# EAGLE board MainECU rev16 (EAGLE 9.6.2), part 1 of 2
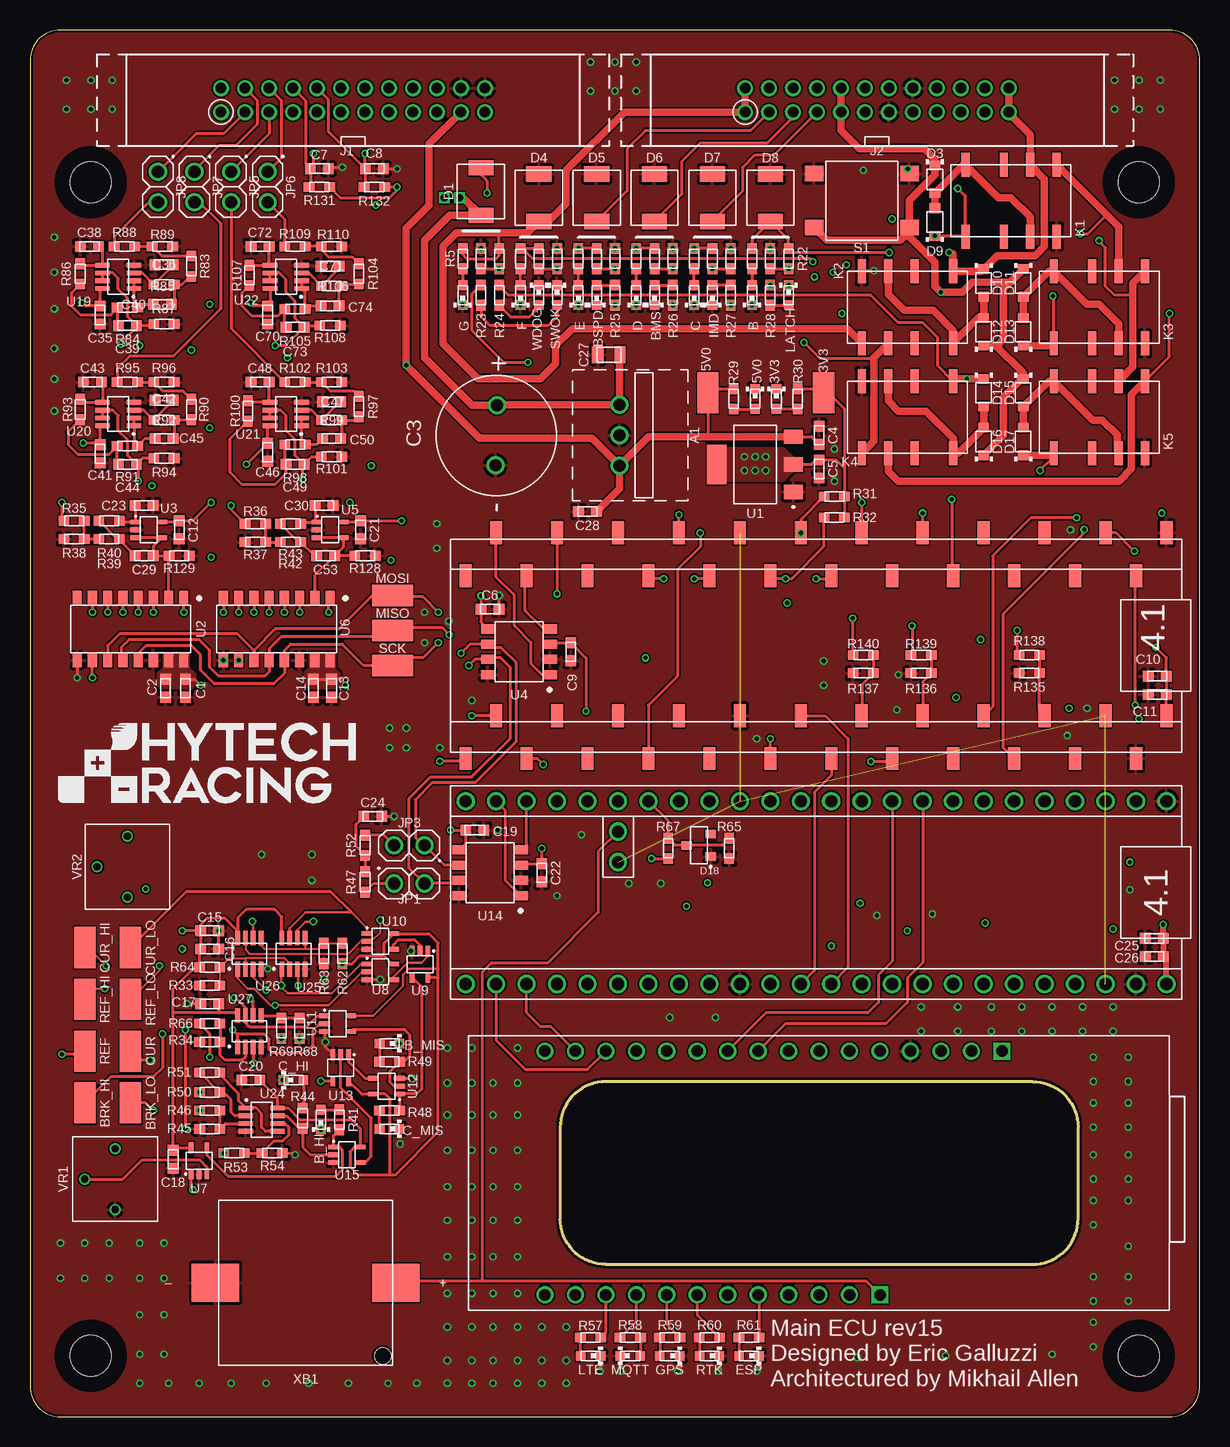
[diagram p9: board, top side]
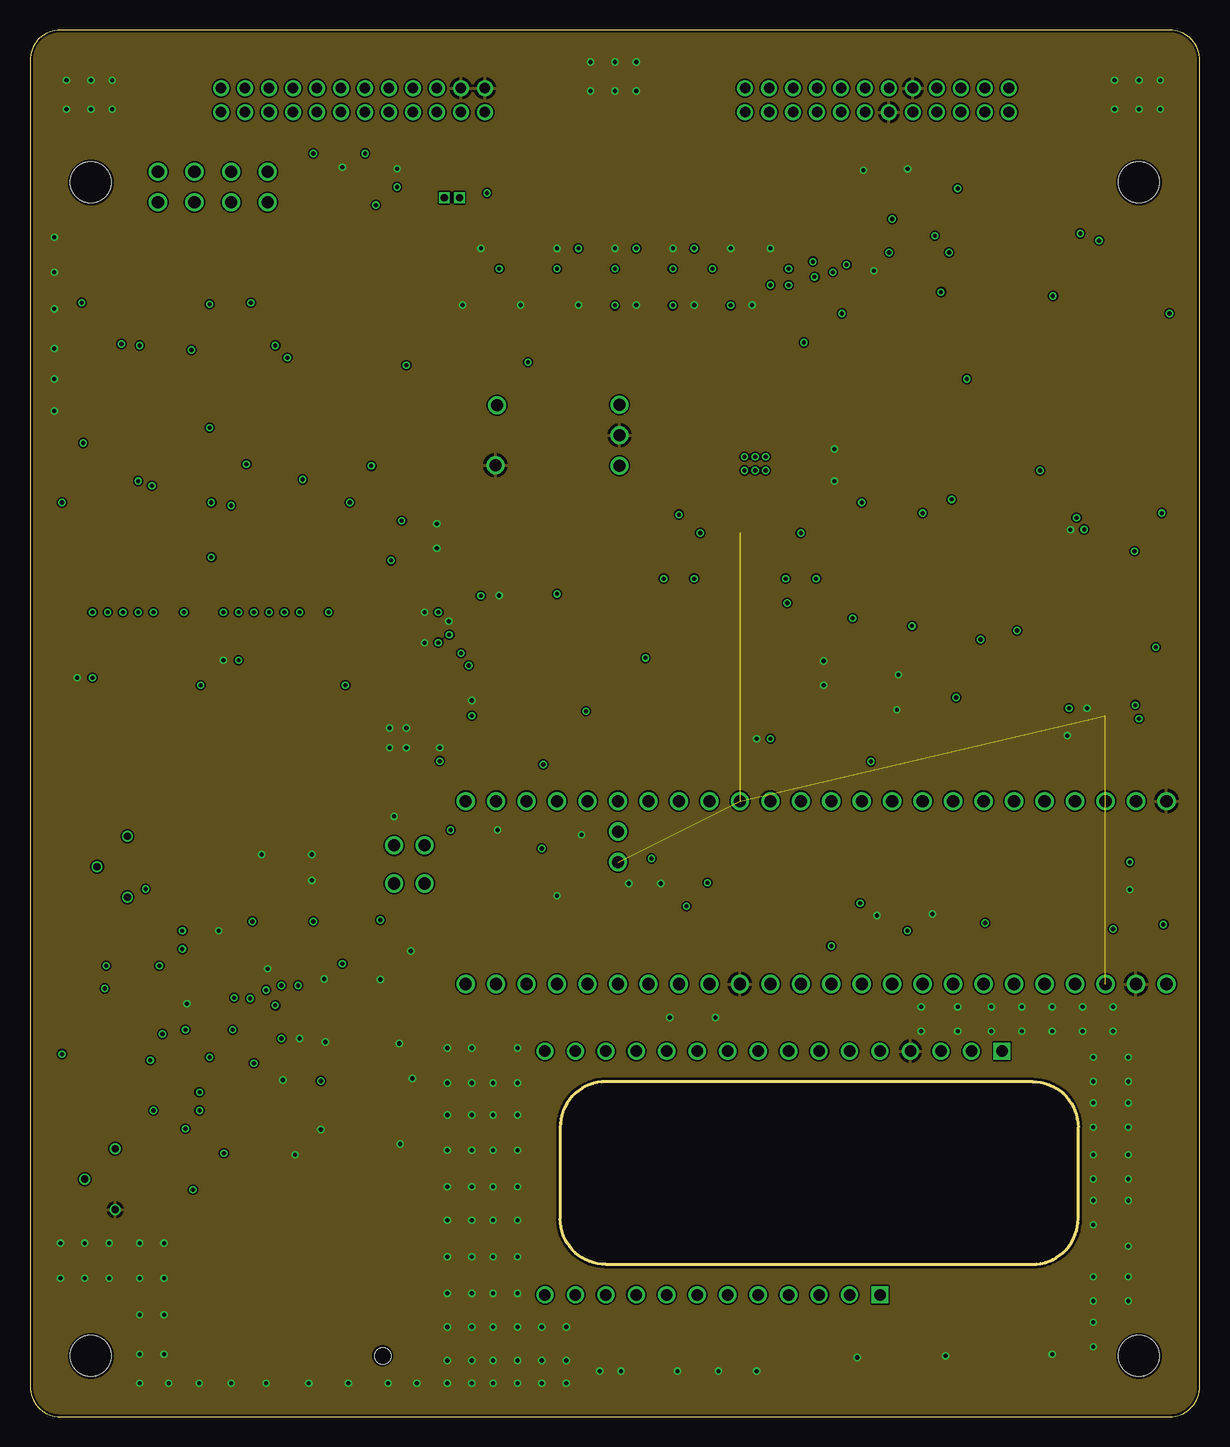
[diagram p10: board, inner layer Route2]
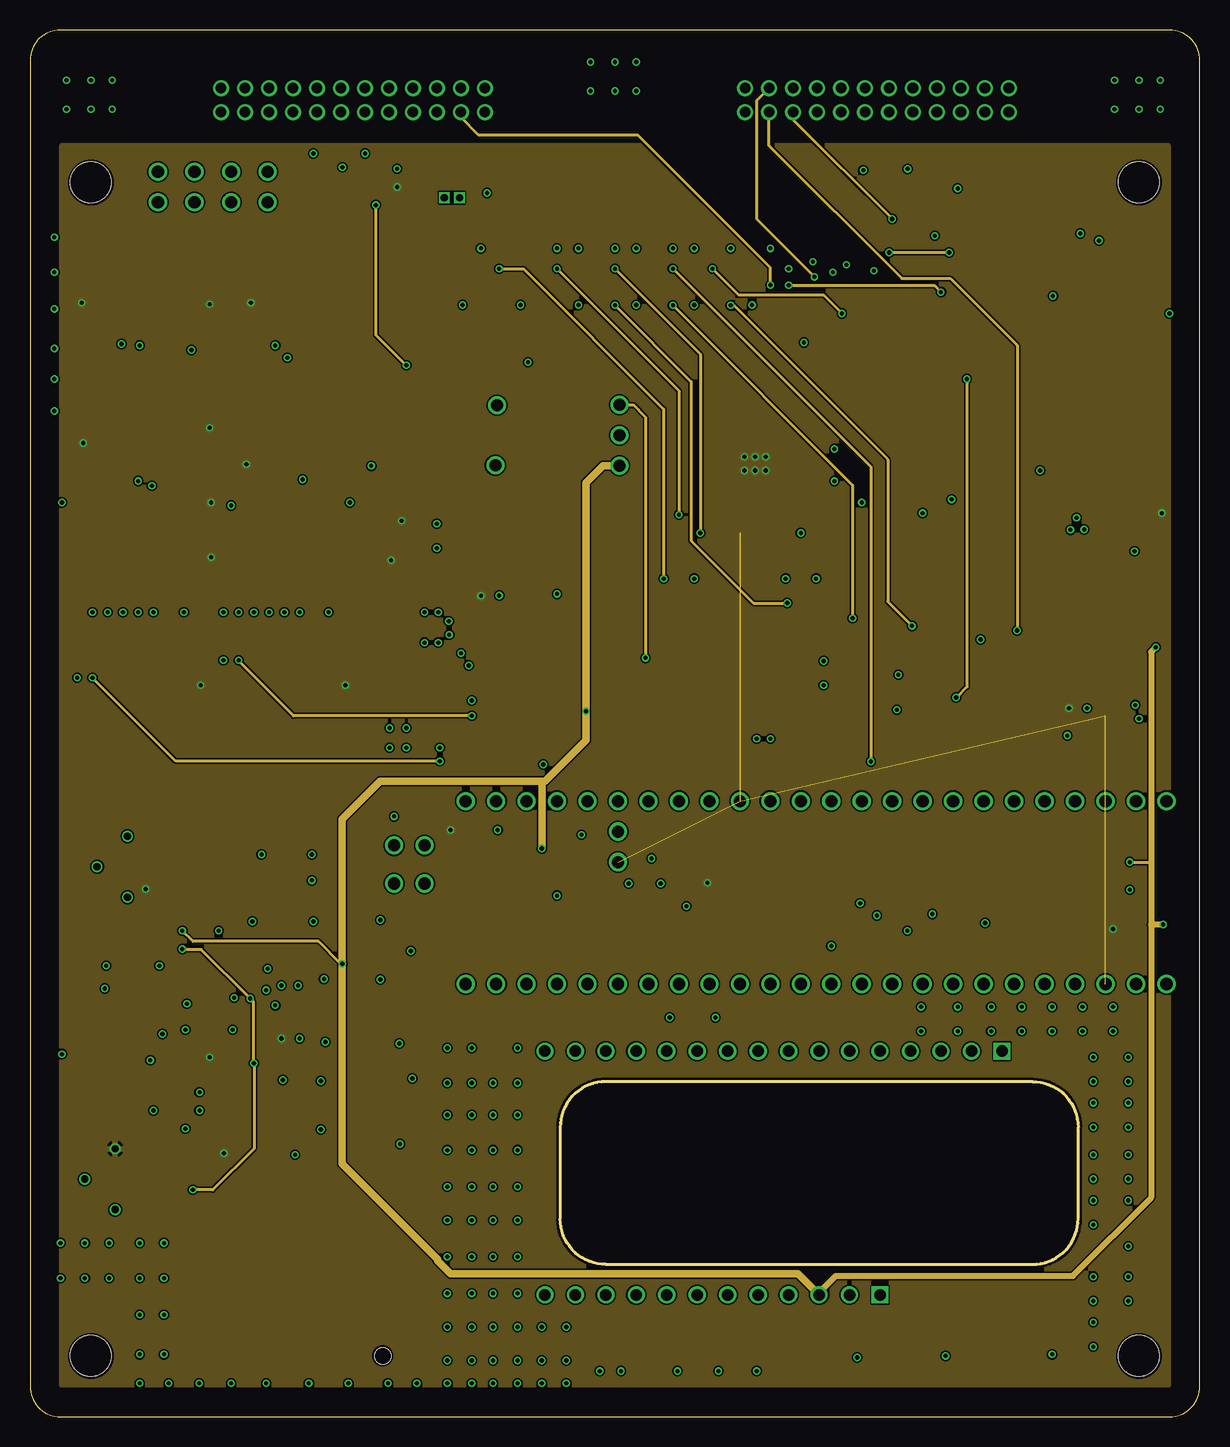
[diagram p11: board, inner layer Route3]
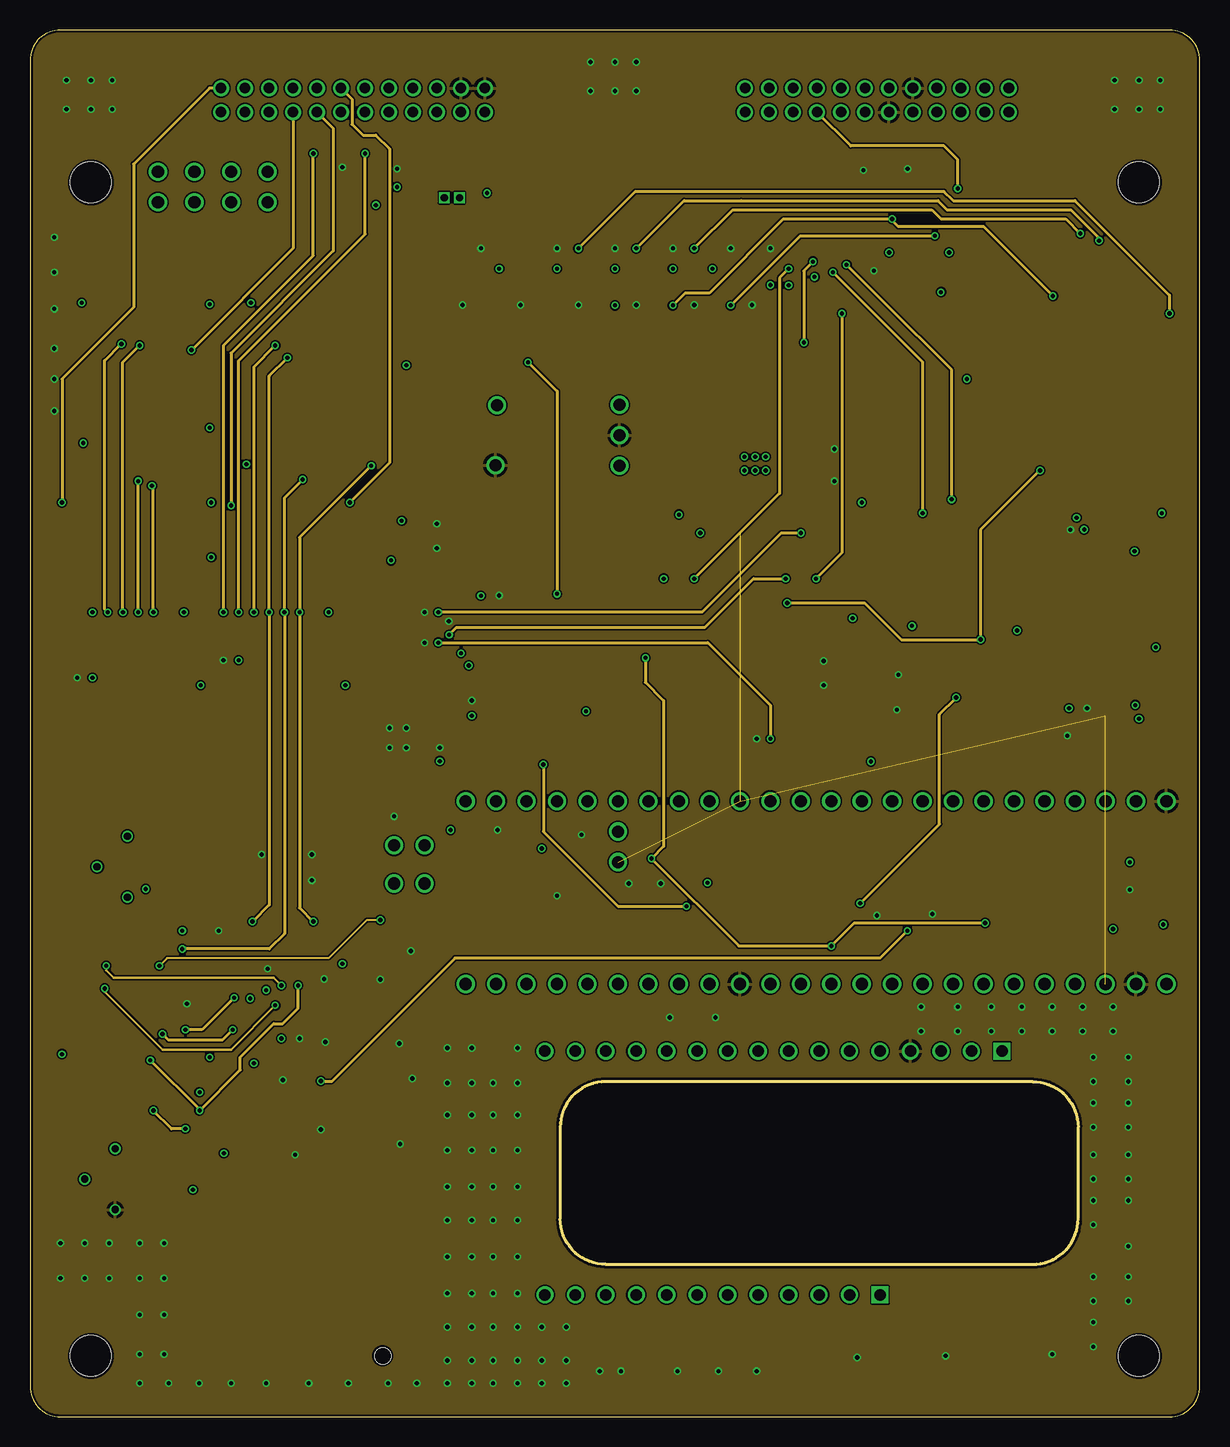
[diagram p12: board, inner layer Route14]
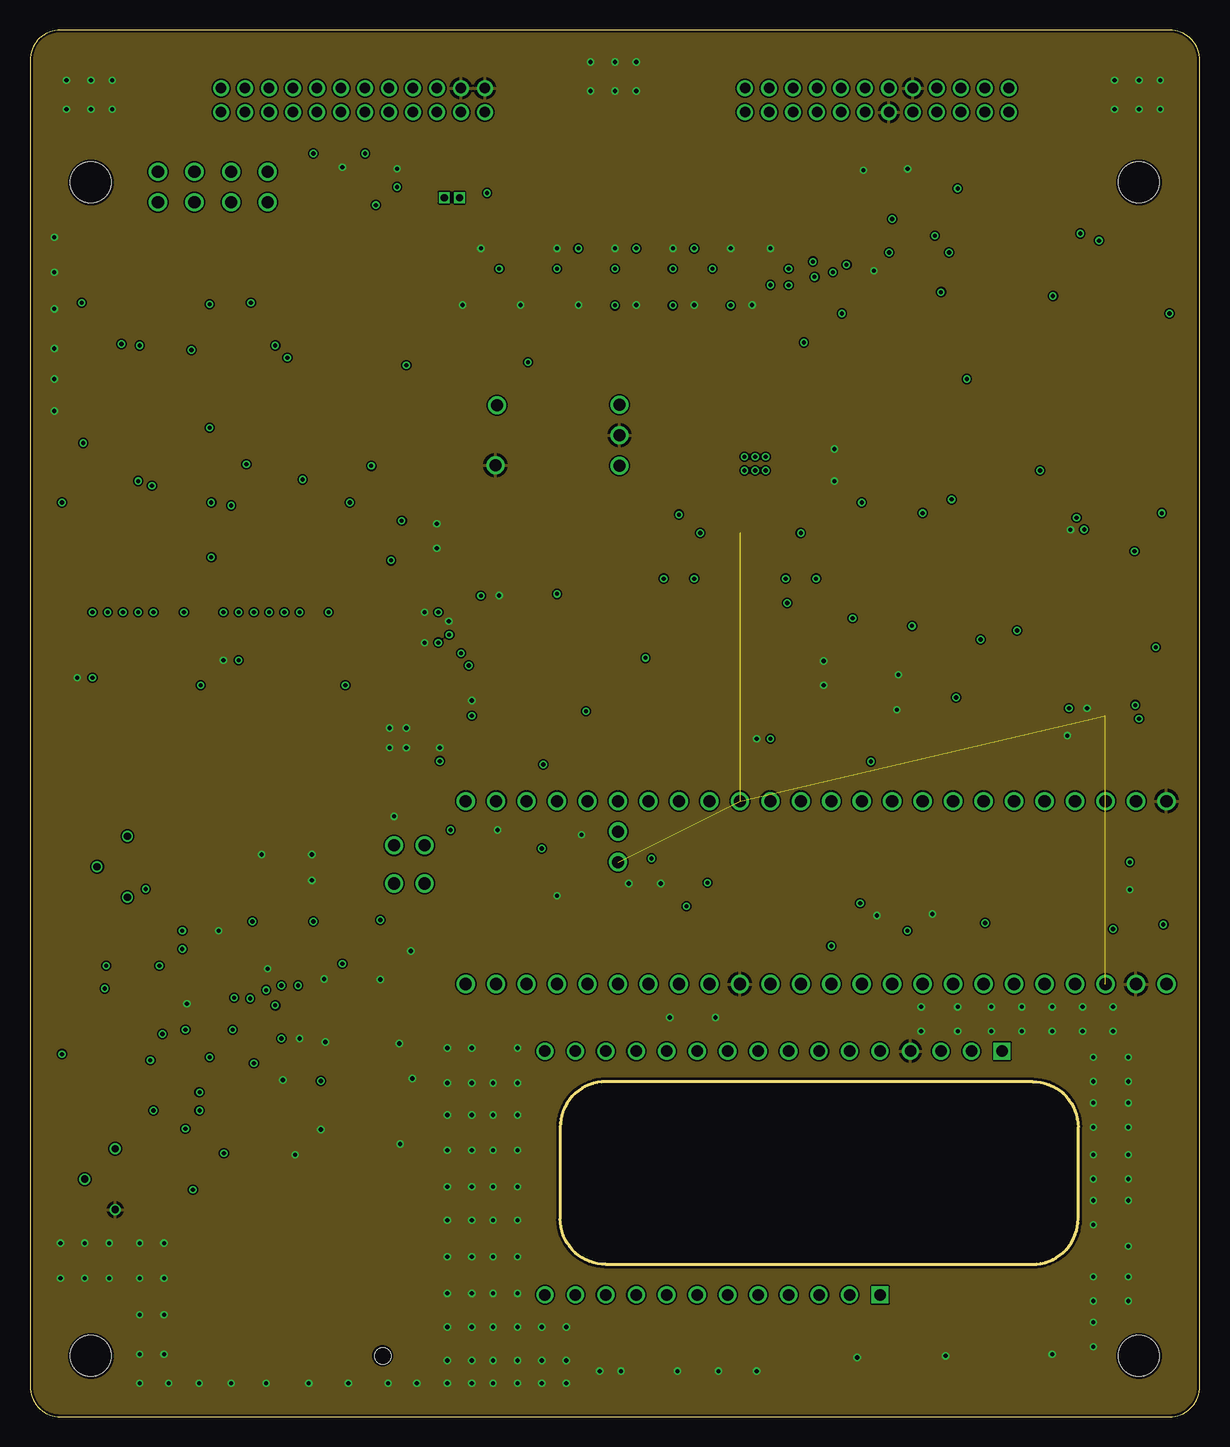
[diagram p13: board, inner layer Route15]
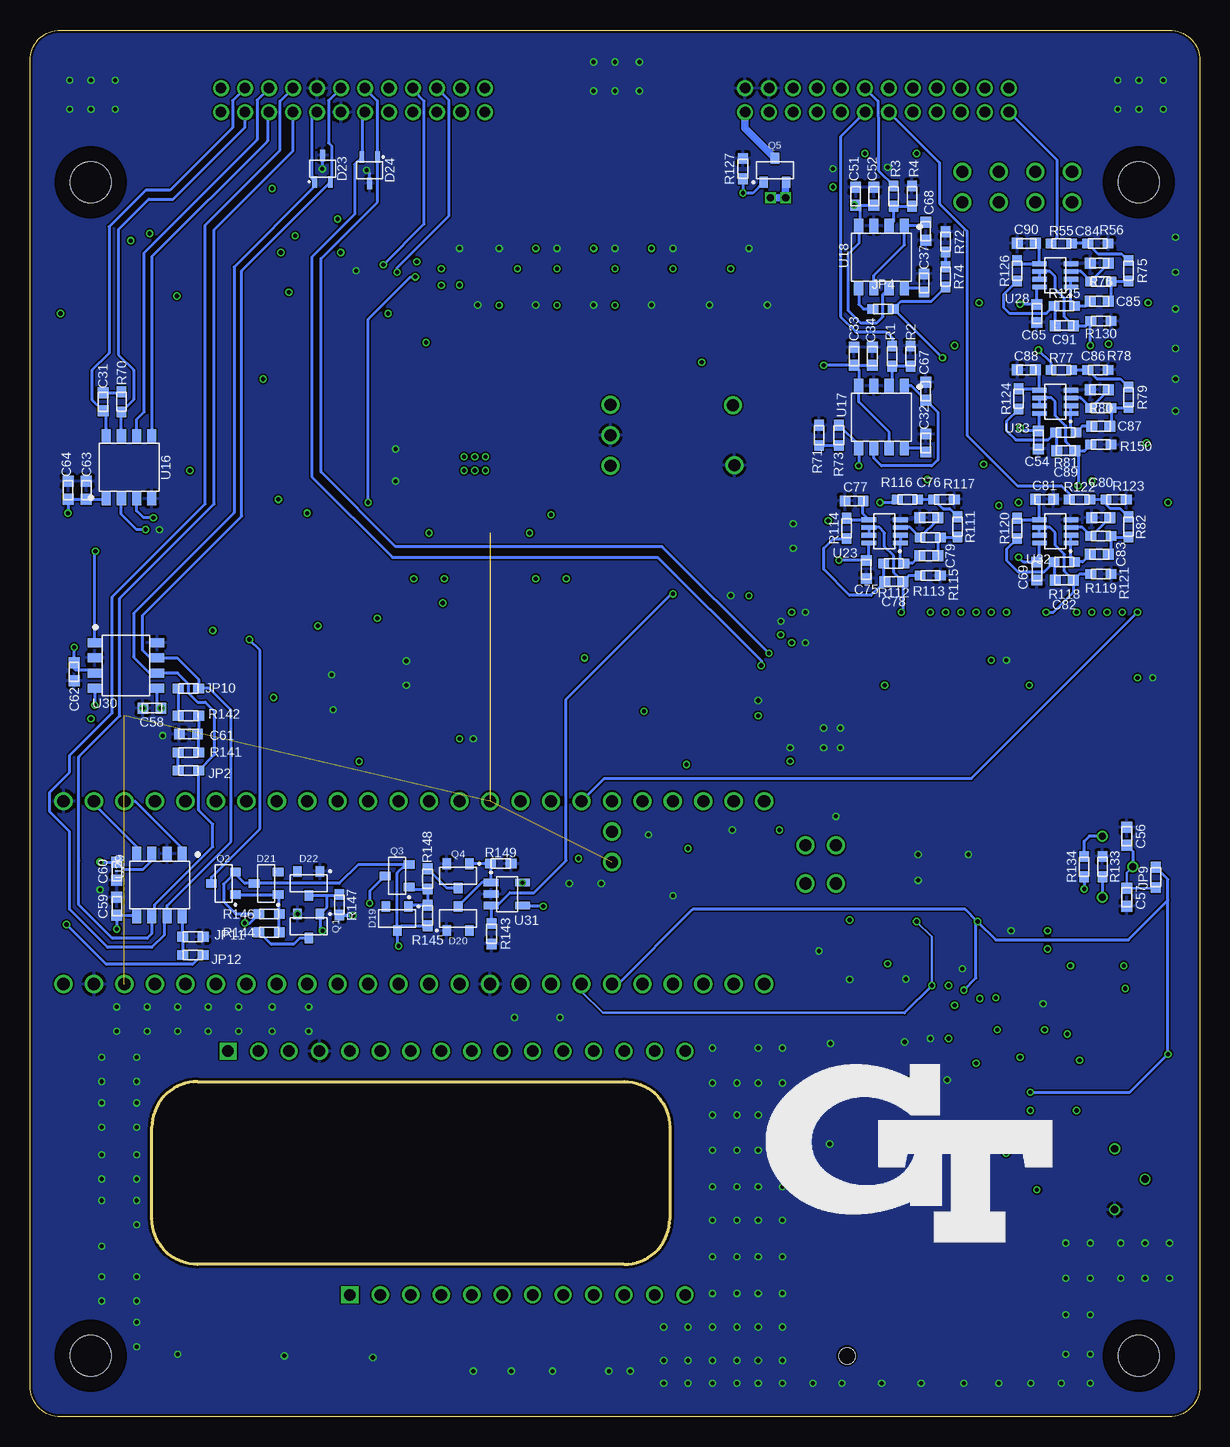
[diagram p14: board, bottom side, seen from below]

Size 97.54 x 115.57 mm. Coordinates in mm from the lower left corner, seen from the top.
Outline: 0,113.03 0,2.54 arc90 2.54,0 95,0 arc90 97.54,2.54 97.54,113.03 arc90 95,115.57 2.54,115.57 arc90 0,113.03
Outline: 44.2,24.13 44.2,16.51 arc90 48.01,12.7 83.57,12.7 arc90 87.38,16.51 87.38,24.13 arc90 83.57,27.94 48.01,27.94 arc90 44.2,24.13
Copper layers (1+2*3+14*15+16): Top 0.035559375mm / dielectric 8mil / Route2 0.035mm / dielectric 15mil / Route3 0.035mm / dielectric 8mil / Route14 0.035mm / dielectric 15mil / Route15 0.035mm / dielectric 8mil / Bottom 0.035559375mm
Design rules "JLCPCB (6 Layer) *": minimum track width 5mil, minimum drill 0.2mm, track to track 5mil, track to pad 5mil, pad to pad 5mil, via to via 20mil, smd to smd 5mil, copper to edge 0.2mm, drill to drill 21mil, minimum pad ring 6mil, minimum via ring 5mil, stop-mask expansion 2mil, vias tented up to drill 30mil, thermal gap 10mil
Net classes: 1 diff pairs: width 0.254 mm

## Footprints (pad centres in the part's own frame; a part is rotated, then mirrored left to right if it is on the bottom)
0603-LED = smd 0.8 x 0.8: 1 -0.825,0; 2 0.825,0
MOUNTING_M3 = hole 3.4: 0,0
OKI-78SR(VERTICAL) = drill 0.991: 1 -2.54,0; 2 0,0; 3 2.54,0
TEENSY_LONG_SSM = smd 1.905 x 1.02: 3.3V -5.842,-24.13; 3.3V@1 9.398,6.35; AGND/GND -9.398,-26.67; D0 5.842,-26.67; D1 9.398,-24.13; D2 5.842,-21.59; D3 9.398,-19.05; D4 5.842,-16.51; D5 9.398,-13.97; D6 5.842,-11.43; D7 9.398,-8.89; D8 5.842,-6.35; D9 9.398,-3.81; D10 5.842,-1.27; D11 9.398,1.27; D12 5.842,3.81; D13 -9.398,3.81; D14 -5.842,1.27; D15 -9.398,-1.27; D16 -5.842,-3.81; D17 -9.398,-6.35; D18 -5.842,-8.89; D19 -9.398,-11.43; D20 -5.842,-13.97; D21 -9.398,-16.51; D22 -5.842,-19.05; D23 -9.398,-21.59; D24 5.842,8.89; D25 9.398,11.43; D26 5.842,13.97; D27 9.398,16.51; D28 5.842,19.05; D29 9.398,21.59; D30 5.842,24.13; D31 9.398,26.67; D32 5.842,29.21; D33 -9.398,29.21; D34 -5.842,26.67; D35 -9.398,24.13; D36 -5.842,21.59; D37 -9.398,19.05; D38 -5.842,16.51; D39 -9.398,13.97; D40 -5.842,11.43; D41 -9.398,8.89; GND 9.398,-29.21; GND@1 -5.842,6.35; VIN -5.842,-29.21
TEENSY_LONG_EXT = drill 1.016: 3V3 0,5.08; 3V3@2 15.24,35.56; 3V3@3 10.16,45.72; AGND/GND 0,2.54; D0 15.24,2.54; D1 15.24,5.08; D2 15.24,7.62; D3 15.24,10.16; D4 15.24,12.7; D5 15.24,15.24; D6 15.24,17.78; D7 15.24,20.32; D8 15.24,22.86; D9 15.24,25.4; D10 15.24,27.94; D11 15.24,30.48; D12 15.24,33.02; D13 0,33.02; D14 0,30.48; D15 0,27.94; D16 0,25.4; D17 0,22.86; D18 0,20.32; D19 0,17.78; D20 0,15.24; D21 0,12.7; D22 0,10.16; D23 0,7.62; D24 15.24,38.1; D25 15.24,40.64; D26 15.24,43.18; D27 15.24,45.72; D28 15.24,48.26; D29 15.24,50.8; D30 15.24,53.34; D31 15.24,55.88; D32 15.24,58.42; D33 0,58.42; D34 0,55.88; D35 0,53.34; D36 0,50.8; D37 0,48.26; D38 0,45.72; D39 0,43.18; D40 0,40.64; D41 0,38.1; GND 15.24,0; GND@2 0,35.56; VBAT 12.7,45.72; VIN 0,0
NRF9160LTE = drill 0.95: 2 -10.16,46.99; 3 -10.16,44.45; 3V3 10.16,16.51; 4 -10.16,41.91; 5 -10.16,39.37; 6 -10.16,36.83; 7 -10.16,34.29; 8 -10.16,31.75; A0 10.16,24.13; A1 10.16,26.67; A2 10.16,29.21; A3 10.16,31.75; A4 10.16,34.29; A5 10.16,36.83; CIPO 10.16,44.45; COPI 10.16,41.91; EN -10.16,26.67; GND 10.16,21.59; MD 10.16,19.05; PS-EN 10.16,52.07; RX 10.16,46.99; SCK 10.16,39.37; SCL/1 -10.16,49.53; SDA/0 -10.16,52.07; TX 10.16,49.53; VUSB -10.16,29.21 | drill 0.95 square: RESET 10.16,13.97; VBAT -10.16,24.13
0603-CAP = smd 0.9 x 0.9: 1 -0.75,0; 2 0.75,0
EEH-AZS = drill 1: MINUS 2.5,0; PLUS -2.5,0
0805-CAP = smd 0.95 x 1.4: 1 -0.925,0; 2 0.925,0
5015 = smd 3.429 x 1.778: 1 0,0
1.5SMBJ = smd 1.27 x 2.1: 1 -1.98,0; 2 1.98,0
SOD-323 = smd 0.8 x 0.9: A -1.15,0; C 1.15,0
SOT-23 = smd 0.711 x 0.889: 1 -0.94,-1.003; 2 0.94,-1.003; 3 0,1.003
SC-70-3 = smd 0.95 x 0.4: 1 -1.1,0.65; 2 -1.1,-0.65; 3 1.1,0
EHT-112-01 = drill 0.889: 1 -10.994,-0.999; 2 -10.994,0.999; 3 -8.995,-0.999; 4 -8.995,0.999; 5 -6.996,-0.999; 6 -6.996,0.999; 7 -4.997,-0.999; 8 -4.997,0.999; 9 -2.998,-0.999; 10 -2.998,0.999; 11 -0.999,-0.999; 12 -0.999,0.999; 13 0.999,-0.999; 14 0.999,0.999; 15 2.998,-0.999; 16 2.998,0.999; 17 4.997,-0.999; 18 4.997,0.999; 19 6.996,-0.999; 20 6.996,0.999; 21 8.995,-0.999; 22 8.995,0.999; 23 10.994,-0.999; 24 10.994,0.999
1X02 = drill 1.016: 1 -1.27,0; 2 1.27,0
0603-RES = smd 0.9 x 0.8: 1 -0.85,0; 2 0.85,0
IM*G = smd 0.7 x 2: 1 -3.8,-3; 2 -0.6,-3; 3 1.6,-3; 4 3.8,-3; 5 3.8,3; 6 1.6,3; 7 -0.6,3; 8 -3.8,3
B3S-100X = smd 1.55 x 1.3: 1 3.975,-2.25; 2 -3.975,-2.25; 3 3.975,2.25; 4 -3.975,2.25
SOT-223 = smd 1.2 x 1.6: 1 -2.3,-3.2; 2 0,-3.2; 3 2.3,-3.2 | smd 3.3 x 1.6: 4 0,3.2
SOIC-16 = smd 0.762 x 1.143: 1 -4.445,-2.603; 2 -3.175,-2.603; 3 -1.905,-2.603; 4 -0.635,-2.603; 5 0.635,-2.603; 6 1.905,-2.603; 7 3.175,-2.603; 8 4.445,-2.603; 9 4.445,2.603; 10 3.175,2.603; 11 1.905,2.603; 12 0.635,2.603; 13 -0.635,2.603; 14 -1.905,2.603; 15 -3.175,2.603; 16 -4.445,2.603
SC-70-5 = smd 0.4 x 0.9: 1 -0.65,-1.1; 2 0,-1.1; 3 0.65,-1.1; 4 0.65,1.1; 5 -0.65,1.1
SOIC-08(NARROW,0.15") = smd 0.762 x 1.143: 1 -1.905,-2.603; 2 -0.635,-2.603; 3 0.635,-2.603; 4 1.905,-2.603; 5 1.905,2.603; 6 0.635,2.603; 7 -0.635,2.603; 8 -1.905,2.603
SOT-23-8 = smd 0.4 x 1.22: 1 -0.975,-1.31; 2 -0.325,-1.31; 3 0.325,-1.31; 4 0.975,-1.31; 5 0.975,1.31; 6 0.325,1.31; 7 -0.325,1.31; 8 -0.975,1.31
SOT-23-5 = smd 0.62 x 1.22: 1 -0.95,-1.31; 2 0,-1.31; 3 0.95,-1.31; 4 0.95,1.31; 5 -0.95,1.31
3362P = drill 0.6: 1 -2.54,0; 2 0,2.54; 3 2.54,0
498 = smd 3.962 x 3.175: 1 -7.518,0; 2 7.518,0 | hole 1.346: -6.426,6.096

## Placement (x,y rotation side)
3V3  LED_0603_YELLOW  [0603-LED]  62.23,84.84 270 top
5V0  LED_0603_YELLOW  [0603-LED]  60.45,84.84 270 top
$$$$U$1  [MOUNTING_M3]  5.08,5.08 0 top
$$$$U$2  [MOUNTING_M3]  92.46,5.08 0 top
$$U$2  [MOUNTING_M3]  92.46,102.87 0 top
A1  VOLTAGE_REGULATOR_MODULE_OKI-78SR_5V  [OKI-78SR(VERTICAL)]  49.15,81.79 270 top
A2  TEENSY_4.1_SMT  [TEENSY_LONG_SSM]  65.53,64.26 90 top
A3  TEENSY_4.1  [TEENSY_LONG_EXT]  94.74,36.07 90 top
A4  NRF9160LTE  [NRF9160LTE]  95,20.32 90 top
B  LED_0603_GREEN  [0603-LED]  60.2,93.47 90 top
B_HI  LED_0603_RED  [0603-LED]  24.26,24.77 90 top
B_MIS  LED_0603_RED  [0603-LED]  29.97,31.11 180 top
BMS  LED_0603_ORANGE  [0603-LED]  52.07,93.47 90 top
BSPD  LED_0603_GREEN  [0603-LED]  47.24,93.47 90 top
C  LED_0603_GREEN  [0603-LED]  55.37,93.47 90 top
C1  CAPACITOR_0603_10V_0.1UF  [0603-CAP]  12.95,60.71 270 top
C2  CAPACITOR_0603_10V_1UF  [0603-CAP]  11.3,60.71 270 top
C3  CAPACITOR_ELECTROLYTIC_EEH_AZS_470UF  [EEH-AZS]  38.86,81.79 268.4 top
C4  CAPACITOR_0603_25V_10UF  [0603-CAP]  65.79,81.79 90 top
C5  CAPACITOR_0603_25V_10UF  [0603-CAP]  65.79,78.99 270 top
C6  CAPACITOR_0603_10V_0.1UF  [0603-CAP]  38.35,67.31 0 top
C7  CAPACITOR_0603_50V_1UF  [0603-CAP]  24.13,104.01 0 top
C8  CAPACITOR_0603_50V_1UF  [0603-CAP]  28.7,104.01 0 top
C9  CAPACITOR_0603_10V_0.1UF  [0603-CAP]  45.09,63.75 270 top
C10  CAPACITOR_0603_10V_0.1UF  [0603-CAP]  93.98,61.72 180 top
C11  CAPACITOR_0603_10V_1UF  [0603-CAP]  93.98,60.2 180 top
C12  CAPACITOR_0603_10V_0.1UF  [0603-CAP]  12.45,73.91 270 top
C13  CAPACITOR_0603_10V_1UF  [0603-CAP]  25.15,60.71 270 top
C14  CAPACITOR_0603_10V_0.1UF  [0603-CAP]  23.62,60.71 270 top
C15  CAPACITOR_0603_10V_0.1UF  [0603-CAP]  14.99,40.51 0 top
C16  CAPACITOR_0603_10V_0.1UF  [0603-CAP]  14.99,38.99 0 top
C17  CAPACITOR_0603_10V_0.1UF  [0603-CAP]  14.99,34.42 180 top
C18  CAPACITOR_0603_10V_0.1UF  [0603-CAP]  11.94,21.46 270 top
C19  CAPACITOR_0603_10V_0.1UF  [0603-CAP]  37.08,48.9 0 top
C20  CAPACITOR_0603_10V_0.1UF  [0603-CAP]  18.41,28.07 180 top
C21  CAPACITOR_0603_10V_0.1UF  [0603-CAP]  27.56,73.91 270 top
C22  CAPACITOR_0603_10V_0.1UF  [0603-CAP]  42.67,45.34 270 top
C23  CAPACITOR_0603_16V_0.47UF  [0603-CAP]  9.53,75.95 180 top
C24  CAPACITOR_0603_10V_4.7NF  [0603-CAP]  28.57,50.04 0 top
C25  CAPACITOR_0603_10V_0.1UF  [0603-CAP]  93.73,39.88 180 top
C26  CAPACITOR_0603_10V_1UF  [0603-CAP]  93.73,38.35 180 top
C27  CAPACITOR_0805_50V_10UF  [0805-CAP]  48.26,88.52 180 top
C28  CAPACITOR_0603_25V_10UF  [0603-CAP]  46.48,75.44 180 top
C29  CAPACITOR_0603_10V_1UF  [0603-CAP]  9.53,71.75 180 top
C30  CAPACITOR_0603_16V_0.47UF  [0603-CAP]  24.51,75.95 180 top
C31  CAPACITOR_0603_25V_1.2NF  [0603-CAP]  91.44,84.58 270 bottom
C32  CAPACITOR_0603_10V_10NF  [0603-CAP]  22.86,81.15 90 bottom
C33  CAPACITOR_0603_10V_0.1UF  [0603-CAP]  28.83,88.39 90 bottom
C34  CAPACITOR_0603_10V_1UF  [0603-CAP]  27.3,88.39 90 bottom
C35  CAPACITOR_0603_10V_0.1UF  [0603-CAP]  5.84,91.82 270 top
C36  CAPACITOR_0603_16V_0.47UF  [0603-CAP]  11.18,96.01 0 top
C37  CAPACITOR_0603_10V_10NF  [0603-CAP]  22.99,94.49 90 bottom
C38  CAPACITOR_0603_16V_0.47UF  [0603-CAP]  4.95,97.54 0 top
C39  CAPACITOR_0603_10V_1UF  [0603-CAP]  8.13,90.93 180 top
C40  CAPACITOR_0603_10V_1UF  [0603-CAP]  11.05,92.71 0 top
C41  CAPACITOR_0603_10V_0.1UF  [0603-CAP]  5.84,80.26 270 top
C42  CAPACITOR_0603_16V_0.47UF  [0603-CAP]  11.18,84.71 0 top
C43  CAPACITOR_0603_16V_0.47UF  [0603-CAP]  5.21,86.23 0 top
C44  CAPACITOR_0603_10V_1UF  [0603-CAP]  8.13,79.38 180 top
C45  CAPACITOR_0603_10V_1UF  [0603-CAP]  11.18,81.53 0 top
C46  CAPACITOR_0603_10V_0.1UF  [0603-CAP]  19.81,80.39 270 top
C47  CAPACITOR_0603_16V_0.47UF  [0603-CAP]  25.15,84.58 0 top
C48  CAPACITOR_0603_16V_0.47UF  [0603-CAP]  19.18,86.23 0 top
C49  CAPACITOR_0603_10V_1UF  [0603-CAP]  22.1,79.38 180 top
C50  CAPACITOR_0603_10V_1UF  [0603-CAP]  25.15,81.53 0 top
C51  CAPACITOR_0603_10V_0.1UF  [0603-CAP]  28.7,101.73 90 bottom
C52  CAPACITOR_0603_10V_1UF  [0603-CAP]  27.18,101.73 90 bottom
C53  CAPACITOR_0603_10V_1UF  [0603-CAP]  24.64,71.75 180 top
C54  CAPACITOR_0603_10V_0.1UF  [0603-CAP]  13.46,81.41 270 bottom
C56  CAPACITOR_0603_10V_1UF  [0603-CAP]  6.1,48.39 90 bottom
C57  CAPACITOR_0603_10V_0.1UF  [0603-CAP]  6.1,43.31 270 bottom
C58  CAPACITOR_0603_10V_0.1UF  [0603-CAP]  87.38,59.05 180 bottom
C59  CAPACITOR_0603_10V_0.1UF  [0603-CAP]  90.3,42.55 90 bottom
C60  CAPACITOR_0603_10V_0.1UF  [0603-CAP]  90.3,45.47 270 bottom
C61  CAPACITOR_0603_10V_4.7NF  [0603-CAP]  84.33,56.9 180 bottom
C62  CAPACITOR_0603_10V_0.1UF  [0603-CAP]  93.85,62.1 270 bottom
C63  CAPACITOR_0603_10V_0.1UF  [0603-CAP]  92.84,77.22 90 bottom
C64  CAPACITOR_0603_10V_1UF  [0603-CAP]  94.36,77.22 90 bottom
C65  CAPACITOR_0603_10V_0.1UF  [0603-CAP]  13.59,91.95 270 bottom
C67  CAPACITOR_0603_10V_0.1UF  [0603-CAP]  22.86,85.47 270 bottom
C68  CAPACITOR_0603_10V_0.1UF  [0603-CAP]  22.86,98.81 270 bottom
C69  CAPACITOR_0603_10V_0.1UF  [0603-CAP]  13.59,70.48 270 bottom
C70  CAPACITOR_0603_10V_0.1UF  [0603-CAP]  19.81,91.82 270 top
C71  CAPACITOR_0603_16V_0.47UF  [0603-CAP]  25.02,95.89 0 top
C72  CAPACITOR_0603_16V_0.47UF  [0603-CAP]  19.18,97.54 0 top
C73  CAPACITOR_0603_10V_1UF  [0603-CAP]  22.1,90.81 180 top
C74  CAPACITOR_0603_10V_1UF  [0603-CAP]  25.02,92.58 0 top
C75  CAPACITOR_0603_10V_0.1UF  [0603-CAP]  27.81,70.61 270 bottom
C76  CAPACITOR_0603_16V_0.47UF  [0603-CAP]  22.61,74.93 0 bottom
C77  CAPACITOR_0603_16V_0.47UF  [0603-CAP]  28.83,76.33 0 bottom
C78  CAPACITOR_0603_10V_1UF  [0603-CAP]  25.53,69.6 180 bottom
C79  CAPACITOR_0603_10V_1UF  [0603-CAP]  22.61,71.75 0 bottom
C80  CAPACITOR_0603_16V_0.47UF  [0603-CAP]  8.26,74.93 0 bottom
C81  CAPACITOR_0603_16V_0.47UF  [0603-CAP]  12.95,76.45 180 bottom
C82  CAPACITOR_0603_10V_1UF  [0603-CAP]  11.3,69.72 180 bottom
C83  CAPACITOR_0603_10V_1UF  [0603-CAP]  8.38,71.88 0 bottom
C84  CAPACITOR_0603_16V_0.47UF  [0603-CAP]  8.38,96.14 0 bottom
C85  CAPACITOR_0603_10V_1UF  [0603-CAP]  8.38,92.96 0 bottom
C86  CAPACITOR_0603_16V_0.47UF  [0603-CAP]  8.38,85.6 0 bottom
C87  CAPACITOR_0603_10V_1UF  [0603-CAP]  8.26,82.55 0 bottom
C88  CAPACITOR_0603_16V_0.47UF  [0603-CAP]  14.48,87.25 0 bottom
C89  CAPACITOR_0603_10V_1UF  [0603-CAP]  11.18,80.52 180 bottom
C90  CAPACITOR_0603_16V_0.47UF  [0603-CAP]  14.48,97.79 0 bottom
C91  CAPACITOR_0603_10V_1UF  [0603-CAP]  11.3,90.93 180 bottom
C_HI  LED_0603_RED  [0603-LED]  21.97,28.07 0 top
C_MIS  LED_0603_RED  [0603-LED]  29.97,24 180 top
CUR  TEST_POINT  [5015]  8.38,30.48 270 top
D  LED_0603_GREEN  [0603-LED]  50.55,93.47 90 top
D1  ZENER_1.5SMBJ_12V  [1.5SMBJ]  37.59,102.11 270 top
D3  SCHOTTKY_SOD323_30V  [SOD-323]  75.44,103.12 90 top
D4  TVS_DO-214AA_30V  [1.5SMBJ]  42.42,101.6 270 top
D5  TVS_DO-214AA_30V  [1.5SMBJ]  47.24,101.6 270 top
D6  TVS_DO-214AA_30V  [1.5SMBJ]  52.07,101.6 270 top
D7  TVS_DO-214AA_30V  [1.5SMBJ]  56.9,101.6 270 top
D8  TVS_DO-214AA_30V  [1.5SMBJ]  61.72,101.6 270 top
D9  SCHOTTKY_SOD323_30V  [SOD-323]  75.44,99.57 270 top
D10  SCHOTTKY_SOD323_30V  [SOD-323]  79.5,94.49 90 top
D11  SCHOTTKY_SOD323_30V  [SOD-323]  82.8,94.49 90 top
D12  SCHOTTKY_SOD323_30V  [SOD-323]  79.5,90.42 270 top
D13  SCHOTTKY_SOD323_30V  [SOD-323]  82.8,90.42 270 top
D14  SCHOTTKY_SOD323_30V  [SOD-323]  79.5,85.34 90 top
D15  SCHOTTKY_SOD323_30V  [SOD-323]  82.8,85.34 90 top
D16  SCHOTTKY_SOD323_30V  [SOD-323]  79.5,81.28 270 top
D17  SCHOTTKY_SOD323_30V  [SOD-323]  82.8,81.28 270 top
D18  TVS__5V  [SOT-23]  55.75,47.62 90 top
D19  TVS__15V  [SOT-23]  66.93,41.53 180 bottom
D20  TVS__15V  [SOT-23]  61.85,41.53 0 bottom
D21  TVS__15V  [SOT-23]  77.85,44.45 90 bottom
D22  TVS__15V  [SOT-23]  74.3,44.45 180 bottom
D23  TVS_BIDIRECTIONAL_DUAL  [SC-70-3]  73.15,104.01 90 bottom
D24  TVS_BIDIRECTIONAL_DUAL  [SC-70-3]  69.22,103.89 270 bottom
E  LED_0603_GREEN  [0603-LED]  45.72,93.47 90 top
ESP  LED_0603_RED  [0603-LED]  59.94,5.08 180 top
F  LED_0603_GREEN  [0603-LED]  40.89,93.47 90 top
G  LED_0603_GREEN  [0603-LED]  36.07,93.47 90 top
GPS  LED_0603_RED  [0603-LED]  53.34,5.08 180 top
IMD  LED_0603_ORANGE  [0603-LED]  56.9,93.47 90 top
J1  CONNECTOR-24_CONNECTOR-24_  [EHT-112-01]  26.92,109.73 0 top
J2  CONNECTOR-24_CONNECTOR-24_  [EHT-112-01]  70.61,109.73 0 top
JP1  JUMPER__1X02  [1X02]  31.62,44.45 0 top
JP2  JUMPER_0603_  [0603-RES]  84.33,53.85 180 bottom
JP3  JUMPER__1X02  [1X02]  31.62,47.62 180 top
JP4  JUMPER_0603_  [0603-RES]  26.42,92.33 180 bottom
JP5  JUMPER__1X02  [1X02]  16.76,102.49 270 top
JP6  JUMPER__1X02  [1X02]  19.81,102.49 270 top
JP7  JUMPER__1X02  [1X02]  13.72,102.49 270 top
JP8  JUMPER__1X02  [1X02]  10.67,102.49 270 top
JP9  DNP  [0603-RES]  3.68,44.96 90 bottom
JP10  JUMPER_0603_  [0603-RES]  84.33,60.71 0 bottom
JP11  DNP  [0603-RES]  83.95,40.01 180 bottom
JP12  JUMPER_0603_  [0603-RES]  83.95,38.48 0 bottom
K1  RELAY_DPDT_07DSMT  [IM*G]  81.79,101.35 0 top
K2  RELAY_DPDT_07DSMT  [IM*G]  73.15,92.46 180 top
K3  RELAY_DPDT_07DSMT  [IM*G]  89.15,92.46 0 top
K4  RELAY_DPDT_07DSMT  [IM*G]  73.15,83.31 180 top
K5  RELAY_DPDT_07DSMT  [IM*G]  89.15,83.31 0 top
LATCH  LED_0603_WHITE  [0603-LED]  63.25,93.47 270 top
LTE  LED_0603_RED  [0603-LED]  46.74,5.08 180 top
MQTT  LED_0603_RED  [0603-LED]  50.04,5.08 0 top
Q1  TRANSISTOR_N_MOS__DMG3406L-7  [SOT-23]  74.3,40.89 180 bottom
Q2  TRANSISTOR_P_MOS_SOT-23_DMP3056L-7  [SOT-23]  81.41,44.45 90 bottom
Q3  TRANSISTOR_P_MOS_SOT-23_DMP3056L-7  [SOT-23]  66.93,45.09 90 bottom
Q4  TRANSISTOR_N_MOS__DMG3406L-7  [SOT-23]  61.85,45.09 180 bottom
Q5  TRANSISTOR_P_MOS_SOT-23_DMP3056L-7  [SOT-23]  35.43,103.89 0 bottom
R1  RESISTOR_0603_10K  [0603-RES]  25.65,88.39 90 bottom
R2  RESISTOR_0603_3.3K  [0603-RES]  24.13,88.39 270 bottom
R3  RESISTOR_0603_10K  [0603-RES]  25.53,101.73 90 bottom
R4  RESISTOR_0603_3.3K  [0603-RES]  24,101.73 270 bottom
R5  RESISTOR_0603_2K  [0603-RES]  36.07,96.52 270 top
R6  RESISTOR_0603_4.64K  [0603-RES]  37.59,96.52 270 top
R7  RESISTOR_0603_36.5K  [0603-RES]  39.12,96.52 90 top
R8  RESISTOR_0603_2K  [0603-RES]  40.89,96.52 270 top
R9  RESISTOR_0603_4.64K  [0603-RES]  43.94,96.52 270 top
R10  RESISTOR_0603_36.5K  [0603-RES]  42.42,96.52 90 top
R11  RESISTOR_0603_2K  [0603-RES]  45.72,96.52 270 top
R12  RESISTOR_0603_4.64K  [0603-RES]  48.77,96.52 270 top
R13  RESISTOR_0603_36.5K  [0603-RES]  47.24,96.52 90 top
R14  RESISTOR_0603_2K  [0603-RES]  50.55,96.52 270 top
R15  RESISTOR_0603_4.64K  [0603-RES]  53.59,96.52 270 top
R16  RESISTOR_0603_36.5K  [0603-RES]  52.07,96.52 90 top
R17  RESISTOR_0603_2K  [0603-RES]  55.37,96.52 270 top
R18  RESISTOR_0603_4.64K  [0603-RES]  58.42,96.52 270 top
R19  RESISTOR_0603_36.5K  [0603-RES]  56.9,96.52 90 top
R20  RESISTOR_0603_2K  [0603-RES]  60.2,96.52 270 top
R21  RESISTOR_0603_4.64K  [0603-RES]  61.72,96.52 270 top
R22  RESISTOR_0603_36.5K  [0603-RES]  63.25,96.52 90 top
R23  RESISTOR_0603_120  [0603-RES]  37.59,93.47 270 top
R24  RESISTOR_0603_2K  [0603-RES]  39.12,93.47 270 top
R25  RESISTOR_0603_2K  [0603-RES]  48.77,93.47 90 top
R26  RESISTOR_0603_2K  [0603-RES]  53.59,93.47 90 top
R27  RESISTOR_0603_2K  [0603-RES]  58.42,93.47 90 top
R28  RESISTOR_0603_180  [0603-RES]  61.72,93.47 90 top
R29  RESISTOR_0603_240  [0603-RES]  58.67,84.84 270 top
R30  RESISTOR_0603_120  [0603-RES]  64.01,84.84 270 top
R31  RESISTOR_0603_2K  [0603-RES]  67.06,76.71 0 top
R32  RESISTOR_0603_2K  [0603-RES]  67.06,74.93 0 top
R33  RESISTOR_0603_10.2K  [0603-RES]  14.99,35.94 0 top
R34  RESISTOR_0603_10.2K  [0603-RES]  14.99,31.24 0 top
R35  RESISTOR_0603_10K  [0603-RES]  3.68,74.68 0 top
R36  RESISTOR_0603_10K  [0603-RES]  18.8,74.42 0 top
R37  RESISTOR_0603_1.24K  [0603-RES]  18.8,72.9 0 top
R38  RESISTOR_0603_1.24K  [0603-RES]  3.68,73.15 0 top
R39  RESISTOR_0603_12K  [0603-RES]  6.6,73.15 180 top
R40  RESISTOR_0603_7.5K  [0603-RES]  6.6,74.68 0 top
R41  RESISTOR_0603_240  [0603-RES]  25.78,24.77 90 top
R42  RESISTOR_0603_12K  [0603-RES]  21.72,72.9 180 top
R43  RESISTOR_0603_7.5K  [0603-RES]  21.72,74.42 0 top
R44  RESISTOR_0603_240  [0603-RES]  22.73,24.89 90 top
R45  RESISTOR_0603_43K  [0603-RES]  14.99,24 180 top
R46  RESISTOR_0603_1K  [0603-RES]  14.99,25.53 0 top
R47  RESISTOR_0603_60.4  [0603-RES]  27.94,44.58 270 top
R48  RESISTOR_0603_240  [0603-RES]  29.97,25.53 180 top
R49  RESISTOR_0603_240  [0603-RES]  29.97,29.59 180 top
R50  RESISTOR_0603_1K  [0603-RES]  14.99,27.05 0 top
R51  RESISTOR_0603_43K  [0603-RES]  14.99,28.7 0 top
R52  RESISTOR_0603_60.4  [0603-RES]  27.94,47.62 270 top
R53  RESISTOR_0603_14K  [0603-RES]  17.02,21.97 180 top
R54  RESISTOR_0603_10K  [0603-RES]  20.19,21.97 180 top
R55  RESISTOR_0603_10K  [0603-RES]  11.56,97.79 0 bottom
R56  RESISTOR_0603_2.74K  [0603-RES]  8.51,97.79 180 bottom
R57  RESISTOR_0603_2K  [0603-RES]  46.74,6.6 180 top
R58  RESISTOR_0603_2K  [0603-RES]  50.04,6.6 0 top
R59  RESISTOR_0603_2K  [0603-RES]  53.34,6.6 180 top
R60  RESISTOR_0603_2K  [0603-RES]  56.64,6.6 180 top
R61  RESISTOR_0603_2K  [0603-RES]  59.94,6.6 180 top
R62  RESISTOR_0603_10.2K  [0603-RES]  26.04,38.61 90 top
R63  RESISTOR_0603_1.13K  [0603-RES]  24.51,38.61 90 top
R64  RESISTOR_0603_1.13K  [0603-RES]  14.99,37.47 0 top
R65  RESISTOR_0603_1.24K  [0603-RES]  58.29,47.37 90 top
R66  RESISTOR_0603_2.55K  [0603-RES]  14.99,32.77 0 top
R67  RESISTOR_0603_10K  [0603-RES]  53.21,47.37 270 top
R68  RESISTOR_0603_2.18K  [0603-RES]  22.48,32.38 90 top
R69  RESISTOR_0603_10K  [0603-RES]  20.95,32.38 90 top
R70  RESISTOR_0603_DNP  [0603-RES]  89.92,84.58 90 bottom
R71  RESISTOR_0603_18.7K  [0603-RES]  31.75,81.79 270 bottom
R72  RESISTOR_0603_18.7K  [0603-RES]  21.21,97.92 270 bottom
R73  RESISTOR_0603_10K  [0603-RES]  30.1,81.79 270 bottom
R74  RESISTOR_0603_10K  [0603-RES]  21.21,95 90 bottom
R75  RESISTOR_0603_12K  [0603-RES]  5.97,95.5 90 bottom
R76  RESISTOR_0603_7.5K  [0603-RES]  8.26,94.61 180 bottom
R77  RESISTOR_0603_10K  [0603-RES]  11.56,87.25 180 bottom
R78  RESISTOR_0603_2.74K  [0603-RES]  8.51,87.25 180 bottom
R79  RESISTOR_0603_12K  [0603-RES]  5.97,84.96 90 bottom
R80  RESISTOR_0603_7.5K  [0603-RES]  8.26,84.07 180 bottom
R81  RESISTOR_0603_12K  [0603-RES]  11.18,82.04 0 bottom
R82  RESISTOR_0603_12K  [0603-RES]  5.97,74.17 270 bottom
R83  RESISTOR_0603_12K  [0603-RES]  13.46,95.89 270 top
R84  RESISTOR_0603_12K  [0603-RES]  8.13,92.46 180 top
R85  RESISTOR_0603_7.5K  [0603-RES]  11.18,94.36 180 top
R86  RESISTOR_0603_7.5K  [0603-RES]  4.19,95.25 90 top
R87  RESISTOR_0603_30K  [0603-RES]  11.18,91.06 180 top
R88  RESISTOR_0603_10K  [0603-RES]  7.87,97.54 0 top
R89  RESISTOR_0603_15K  [0603-RES]  11.05,97.54 180 top
R90  RESISTOR_0603_12K  [0603-RES]  13.46,83.95 270 top
R91  RESISTOR_0603_12K  [0603-RES]  8.13,80.9 180 top
R92  RESISTOR_0603_7.5K  [0603-RES]  11.18,83.06 180 top
R93  RESISTOR_0603_7.5K  [0603-RES]  4.19,83.95 90 top
R94  RESISTOR_0603_30K  [0603-RES]  11.18,79.88 180 top
R95  RESISTOR_0603_10K  [0603-RES]  8.13,86.23 0 top
R96  RESISTOR_0603_15K  [0603-RES]  11.18,86.23 180 top
R97  RESISTOR_0603_12K  [0603-RES]  27.43,84.2 270 top
R98  RESISTOR_0603_12K  [0603-RES]  22.1,81.03 180 top
R99  RESISTOR_0603_7.5K  [0603-RES]  25.15,83.06 180 top
R100  RESISTOR_0603_7.5K  [0603-RES]  18.16,83.82 90 top
R101  RESISTOR_0603_30K  [0603-RES]  25.15,80.01 180 top
R102  RESISTOR_0603_10K  [0603-RES]  22.1,86.23 0 top
R103  RESISTOR_0603_15K  [0603-RES]  25.15,86.23 180 top
R104  RESISTOR_0603_12K  [0603-RES]  27.43,95.25 270 top
R105  RESISTOR_0603_12K  [0603-RES]  22.1,92.33 180 top
R106  RESISTOR_0603_7.5K  [0603-RES]  25.15,94.23 180 top
R107  RESISTOR_0603_7.5K  [0603-RES]  18.29,95.12 90 top
R108  RESISTOR_0603_30K  [0603-RES]  25.02,90.93 180 top
R109  RESISTOR_0603_10K  [0603-RES]  22.1,97.54 0 top
R110  RESISTOR_0603_15K  [0603-RES]  25.15,97.54 180 top
R111  RESISTOR_0603_12K  [0603-RES]  20.19,74.17 270 bottom
R112  RESISTOR_0603_12K  [0603-RES]  25.53,71.12 180 bottom
R113  RESISTOR_0603_7.5K  [0603-RES]  22.48,73.28 180 bottom
R114  RESISTOR_0603_7.5K  [0603-RES]  29.46,74.04 90 bottom
R115  RESISTOR_0603_30K  [0603-RES]  22.48,70.1 180 bottom
R116  RESISTOR_0603_10K  [0603-RES]  24.38,76.45 0 bottom
R117  RESISTOR_0603_15K  [0603-RES]  21.34,76.45 180 bottom
R118  RESISTOR_0603_12K  [0603-RES]  11.3,71.25 180 bottom
R119  RESISTOR_0603_7.5K  [0603-RES]  8.26,73.41 180 bottom
R120  RESISTOR_0603_7.5K  [0603-RES]  15.24,74.04 90 bottom
R121  RESISTOR_0603_30K  [0603-RES]  8.26,70.23 180 bottom
R122  RESISTOR_0603_10K  [0603-RES]  10.03,76.45 0 bottom
R123  RESISTOR_0603_15K  [0603-RES]  6.99,76.45 180 bottom
R124  RESISTOR_0603_7.5K  [0603-RES]  15.11,84.84 90 bottom
R125  RESISTOR_0603_12K  [0603-RES]  11.3,92.58 0 bottom
R126  RESISTOR_0603_7.5K  [0603-RES]  15.24,95.5 90 bottom
R127  RESISTOR_0603_100K  [0603-RES]  38.1,104.01 270 bottom
R128  RESISTOR_0603_20K  [0603-RES]  27.94,71.75 180 top
R129  RESISTOR_0603_20K  [0603-RES]  12.45,71.75 180 top
R130  RESISTOR_0603_20K  [0603-RES]  8.26,91.31 180 bottom
R131  RESISTOR_0603_8.35K  [0603-RES]  24.13,102.49 180 top
R132  RESISTOR_0603_8.35K  [0603-RES]  28.7,102.49 180 top
R133  RESISTOR_0603_10K  [0603-RES]  8.13,45.85 270 bottom
R134  RESISTOR_0603_10K  [0603-RES]  9.65,45.85 270 bottom
R135  RESISTOR_0603_4.64K  [0603-RES]  83.31,61.98 0 top
R136  RESISTOR_0603_4.64K  [0603-RES]  74.3,61.98 0 top
R137  RESISTOR_0603_4.64K  [0603-RES]  69.47,61.98 0 top
R138  RESISTOR_0603_36.5K  [0603-RES]  83.31,63.5 180 top
R139  RESISTOR_0603_36.5K  [0603-RES]  74.3,63.5 180 top
R140  RESISTOR_0603_36.5K  [0603-RES]  69.47,63.5 180 top
R141  RESISTOR_0603_60.4  [0603-RES]  84.33,55.37 0 bottom
R142  RESISTOR_0603_60.4  [0603-RES]  84.33,58.42 180 bottom
R143  RESISTOR_0603_10K  [0603-RES]  59.05,40.26 90 bottom
R144  RESISTOR_0603_5.1K  [0603-RES]  77.6,40.39 0 bottom
R145  RESISTOR_0603_5.1K  [0603-RES]  64.39,41.78 270 bottom
R146  RESISTOR_0603_5.1K  [0603-RES]  77.6,41.91 180 bottom
R147  RESISTOR_0603_10K  [0603-RES]  71.75,42.67 90 bottom
R148  RESISTOR_0603_5.1K  [0603-RES]  64.39,44.83 270 bottom
R149  RESISTOR_0603_10K  [0603-RES]  58.29,46.1 180 bottom
R150  RESISTOR_0603_20K  [0603-RES]  8.26,81.03 180 bottom
RTK  LED_0603_RED  [0603-LED]  56.64,5.08 180 top
S1  BUTTON  [B3S-100X]  69.34,101.35 0 top
SWOK  LED_0603_ORANGE  [0603-LED]  43.94,93.47 270 top
TP1  TEST_POINT  [5015]  56.52,85.34 90 top
TP2  TEST_POINT  [5015]  66.17,85.34 270 top
TP3  TEST_POINT  [5015]  4.57,34.8 270 top
TP4  TEST_POINT  [5015]  4.57,39.12 270 top
TP6  TEST_POINT  [5015]  8.38,34.8 270 top
TP7  TEST_POINT  [5015]  8.38,39.12 270 top
TP8  TEST_POINT  [5015]  4.57,26.16 270 top
TP9  TEST_POINT  [5015]  8.38,26.16 270 top
TP10  TEST_POINT  [5015]  30.23,62.61 0 top
TP11  TEST_POINT  [5015]  30.23,65.53 180 top
TP12  TEST_POINT  [5015]  30.23,68.45 0 top
TP13  TEST_POINT  [5015]  4.57,30.48 90 top
U1  VOLTAGE_REGULATOR_SOT-223_3.3V  [SOT-223]  60.45,79.38 90 top
U2  MCP3208  [SOIC-16]  8.38,65.66 180 top
U3  OPAMP_1_CHANNEL_OPA991  [SC-70-5]  9.91,73.91 270 top
U4  TCAN1051HQV-Q1  [SOIC-08(NARROW,0.15")]  40.77,63.75 90 top
U5  OPAMP_1_CHANNEL_OPA991  [SC-70-5]  25.02,73.91 270 top
U6  MCP3208  [SOIC-16]  20.57,65.66 180 top
U7  OPAMP_1_CHANNEL_OPA991  [SC-70-5]  14.1,21.34 0 top
U8  LOGICGATE_OR  [SC-70-5]  29.21,37.08 270 top
U9  LOGICGATE_OR  [SC-70-5]  32.51,37.72 180 top
U10  LOGICGATE_OR  [SC-70-5]  29.21,39.62 270 top
U11  LOGICGATE_OR  [SC-70-5]  25.65,32.77 270 top
U12  LOGICGATE_OR  [SC-70-5]  29.72,27.56 90 top
U13  LOGICGATE_NOR  [SC-70-5]  25.91,29.08 180 top
U14  TCAN1051HQV-Q1  [SOIC-08(NARROW,0.15")]  38.35,45.34 90 top
U15  LOGICGATE_AND_DCK3  [SC-70-5]  26.42,21.84 270 top
U16  MAX3074EESA+  [SOIC-08(NARROW,0.15")]  89.28,79.12 0 bottom
U17  MAX7400  [SOIC-08(NARROW,0.15")]  26.54,83.31 180 bottom
U18  MAX7400  [SOIC-08(NARROW,0.15")]  26.54,96.65 180 bottom
U19  OPAMP_2_CHANNEL_OPA_2991  [SOT-23-8]  7.37,95 90 top
U20  OPAMP_2_CHANNEL_OPA_2991  [SOT-23-8]  7.37,83.57 90 top
U21  OPAMP_2_CHANNEL_OPA_2991  [SOT-23-8]  21.34,83.57 90 top
U22  OPAMP_2_CHANNEL_OPA_2991  [SOT-23-8]  21.34,95 90 top
U23  OPAMP_2_CHANNEL_OPA_2991  [SOT-23-8]  26.29,73.79 90 bottom
U24  OPAMP_2_CHANNEL_OPA_2991  [SOT-23-8]  19.3,24.77 270 top
U25  OPAMP_2_CHANNEL_OPA_2991  [SOT-23-8]  21.97,38.61 0 top
U26  OPAMP_2_CHANNEL_OPA_2991  [SOT-23-8]  18.29,38.61 0 top
U27  OPAMP_2_CHANNEL_OPA_2991  [SOT-23-8]  18.29,32.13 0 top
U28  OPAMP_2_CHANNEL_OPA_2991  [SOT-23-8]  12.06,95.12 90 bottom
U29  TCAN1051HQV-Q1  [SOIC-08(NARROW,0.15")]  86.74,44.32 180 bottom
U30  TCAN1051HQV-Q1  [SOIC-08(NARROW,0.15")]  89.53,62.61 270 bottom
U31  ADM8316WBX30  [SOT-23-5]  57.78,43.56 270 bottom
U32  OPAMP_2_CHANNEL_OPA_2991  [SOT-23-8]  12.06,73.79 90 bottom
U33  OPAMP_2_CHANNEL_OPA_2991  [SOT-23-8]  12.06,84.58 90 bottom
U$1  [MOUNTING_M3]  5.08,102.87 0 top
U$3  [LOGO_HYTECH_MEDIUM]  2.29,51.18 0 top
U$5  [LOGO_GT_LARGE]  24.26,21.97 0 bottom
VR1  RESISTOR_TRIMPOT_10K_3362P  [3362P]  7.11,19.81 90 top
VR2  RESISTOR_TRIMPOT_10K_3362P  [3362P]  8.13,45.85 90 top
WDOG  LED_0603_ORANGE  [0603-LED]  42.42,93.47 270 top
XB1  BATTERY_HOLDER_KEYSTONE_498  [498]  22.99,11.18 180 top